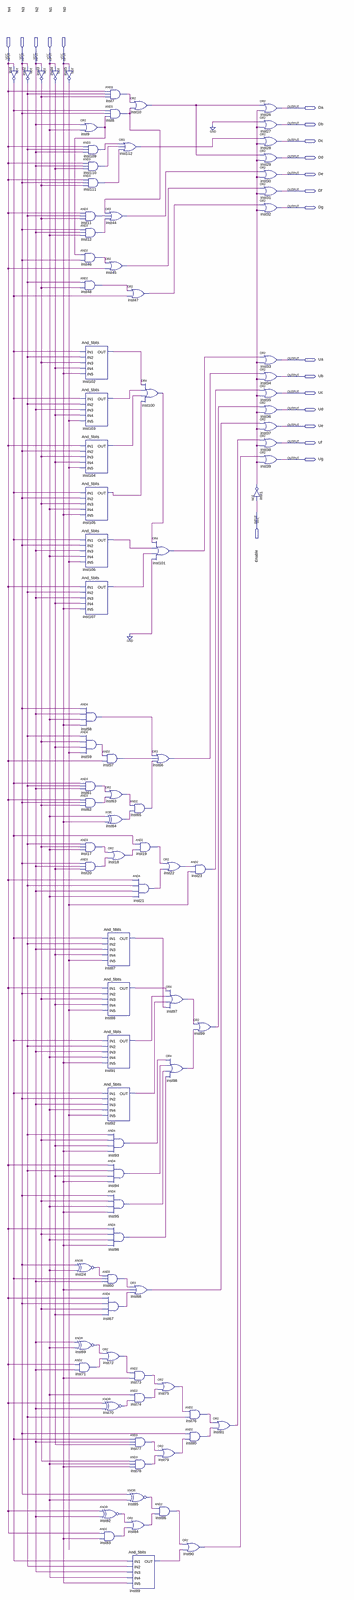
[diagram p0: schematic sheet, whole]
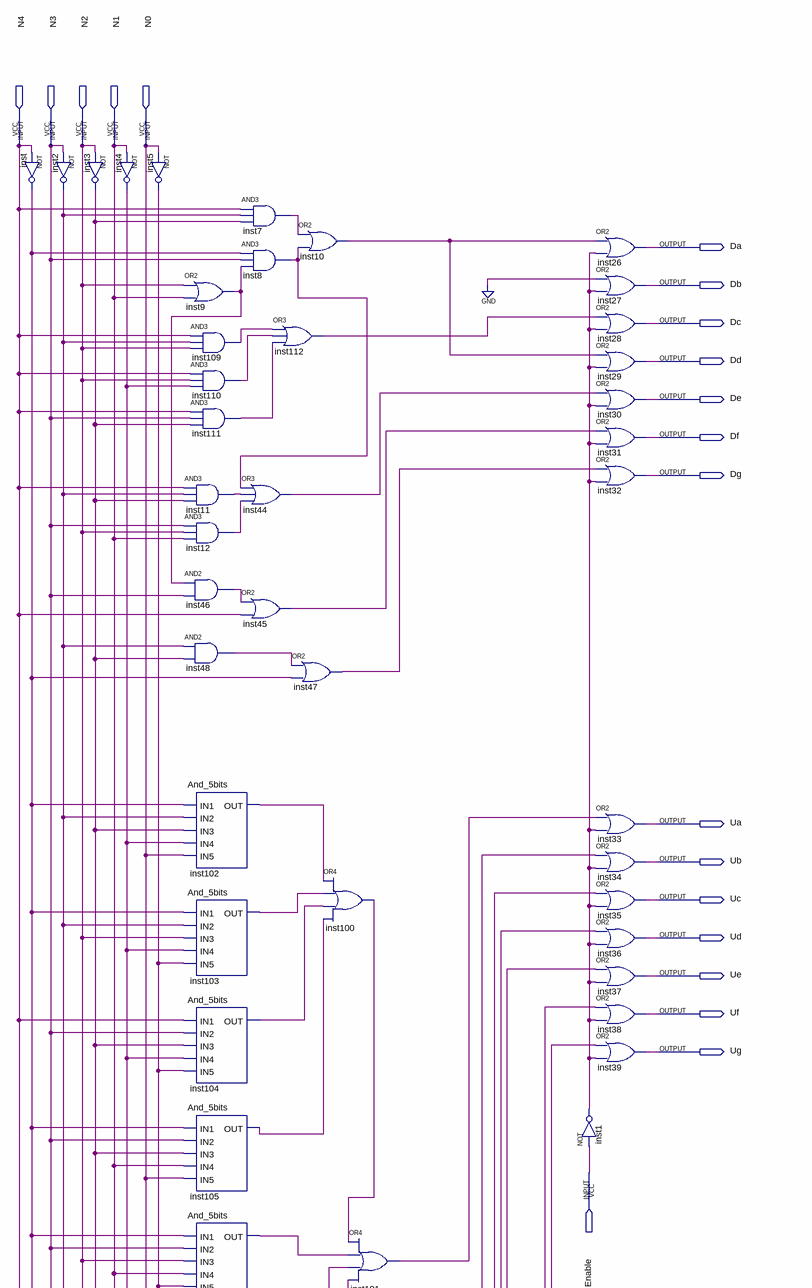
[diagram p1: schematic sheet, upper part]
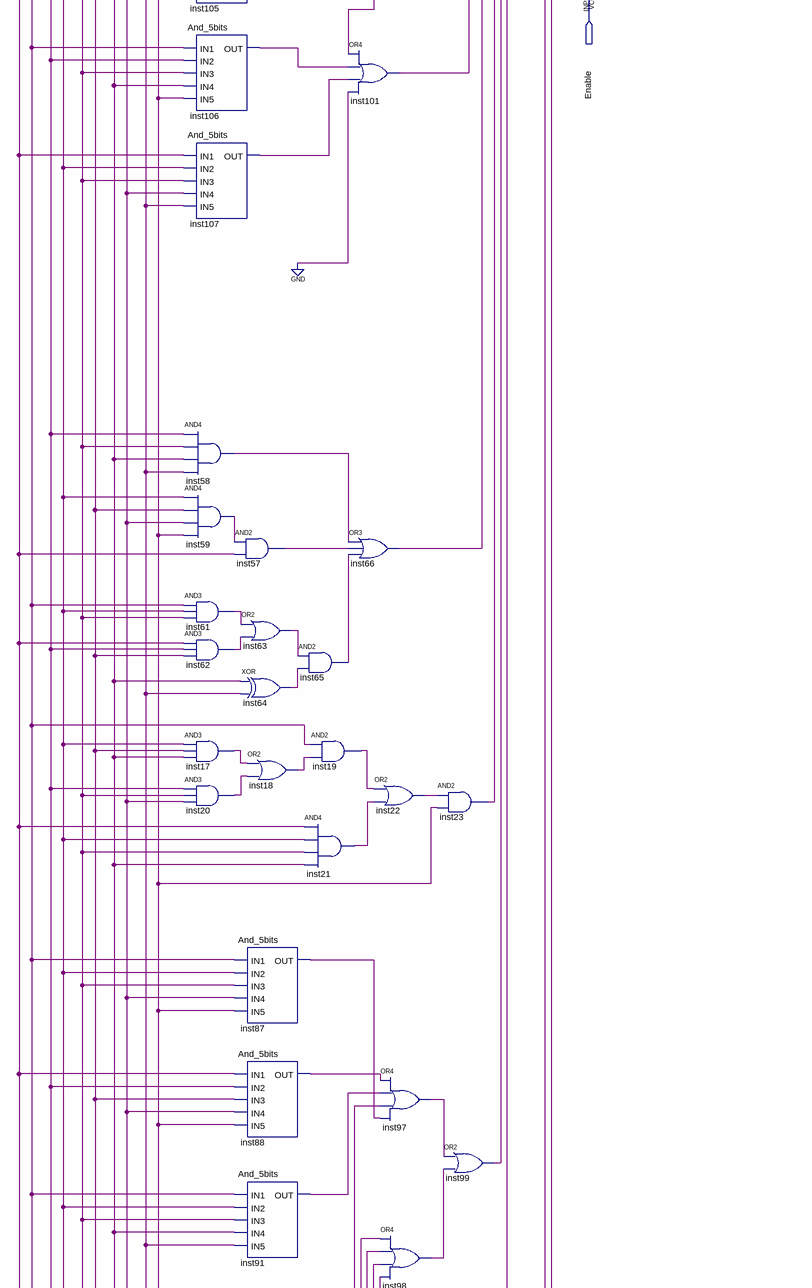
[diagram p2: schematic sheet, middle part]
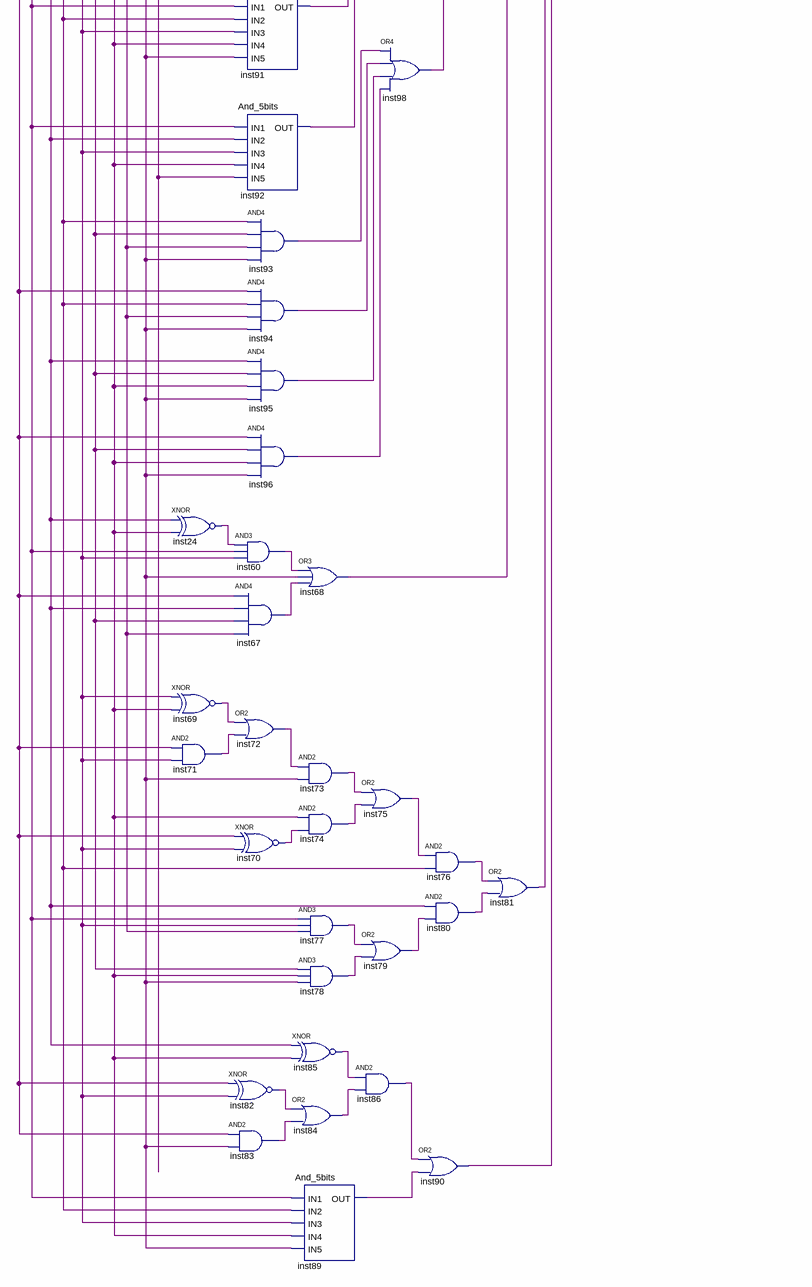
[diagram p3: schematic sheet, lower part]
// Quartus schematic 5-decoder-7-seg-2-dig.bdf as structural Verilog: 94 symbols, 20 pins
module \5-decoder-7-seg-2-dig  (
  input  N4,
  input  N3,
  input  N2,
  input  N1,
  input  N0,
  input  Enable,
  output Da,
  output Db,
  output Dc,
  output Dd,
  output De,
  output Df,
  output Dg,
  output Ua,
  output Ub,
  output Uc,
  output Ud,
  output Ue,
  output Uf,
  output Ug
);

  wire inst1_out, inst2_out, inst3_out, inst4_out, inst5_out, inst7_out, inst8_out, inst9_out, inst10_out,
       inst11_out, inst12_out, inst17_out, inst18_out, inst19_out, inst20_out, inst21_out, inst22_out,
       inst23_out, inst24_out, inst44_out, inst45_out, inst46_out, inst47_out, inst48_out, inst57_out,
       inst58_out, inst59_out, inst60_out, inst61_out, inst62_out, inst63_out, inst64_out, inst65_out,
       inst66_out, inst67_out, inst68_out, inst69_out, inst70_out, inst71_out, inst72_out, inst73_out,
       inst74_out, inst75_out, inst76_out, inst77_out, inst78_out, inst79_out, inst80_out, inst81_out,
       inst82_out, inst83_out, inst84_out, inst85_out, inst86_out, inst87_out, inst88_out, inst89_out,
       inst90_out, inst91_out, inst92_out, inst93_out, inst94_out, inst95_out, inst96_out, inst97_out,
       inst98_out, inst99_out, inst100_out, inst101_out, inst102_out, inst103_out, inst104_out, inst105_out,
       inst106_out, inst107_out, inst109_out, inst110_out, inst111_out, inst112_out, inst_out;

  not inst (inst_out, N4);
  not inst2 (inst2_out, N3);
  not inst3 (inst3_out, N2);
  not inst4 (inst4_out, N1);
  not inst5 (inst5_out, N0);
  or inst9 (inst9_out, N2, N1);
  and inst109 (inst109_out, N4, inst2_out, N2);
  and inst110 (inst110_out, N4, N2, inst4_out);
  and inst111 (inst111_out, N4, N3, inst3_out);
  and inst11 (inst11_out, N4, inst2_out, inst3_out);
  and inst12 (inst12_out, N3, N2, N1);
  and inst46 (inst46_out, inst9_out, N3);
  and inst48 (inst48_out, inst2_out, inst3_out);
  And_5bits inst102 (.IN1(inst_out), .IN2(inst2_out), .IN3(inst3_out), .IN4(inst4_out), .IN5(N0), .OUT(inst102_out));
  And_5bits inst103 (.IN1(inst_out), .IN2(inst2_out), .IN3(N2), .IN4(inst4_out), .IN5(inst5_out), .OUT(inst103_out));
  And_5bits inst104 (.IN1(N4), .IN2(N3), .IN3(inst3_out), .IN4(inst4_out), .IN5(inst5_out), .OUT(inst104_out));
  And_5bits inst105 (.IN1(inst_out), .IN2(N3), .IN3(inst3_out), .IN4(N1), .IN5(N0), .OUT(inst105_out));
  And_5bits inst106 (.IN1(inst_out), .IN2(N3), .IN3(N2), .IN4(N1), .IN5(inst5_out), .OUT(inst106_out));
  And_5bits inst107 (.IN1(N4), .IN2(inst2_out), .IN3(N2), .IN4(inst4_out), .IN5(N0), .OUT(inst107_out));
  and inst58 (inst58_out, N3, N2, N1, N0);
  and inst59 (inst59_out, inst2_out, inst3_out, inst4_out, inst5_out);
  and inst61 (inst61_out, inst_out, inst2_out, N2);
  and inst62 (inst62_out, N4, N3, inst3_out);
  and inst17 (inst17_out, inst2_out, inst3_out, N1);
  and inst20 (inst20_out, N3, N2, inst4_out);
  xnor inst24 (inst24_out, N3, N1);
  xnor inst69 (inst69_out, N2, N1);
  and inst71 (inst71_out, N4, N2);
  and inst7 (inst7_out, N4, inst2_out, inst3_out);
  and inst8 (inst8_out, inst_out, N3, inst9_out);
  or inst44 (inst44_out, inst8_out, inst11_out, inst12_out);
  or inst45 (inst45_out, inst46_out, N4);
  and inst57 (inst57_out, inst59_out, N4);
  or inst63 (inst63_out, inst61_out, inst62_out);
  xor inst64 (inst64_out, N1, N0);
  And_5bits inst87 (.IN1(inst_out), .IN2(inst2_out), .IN3(N2), .IN4(inst4_out), .IN5(inst5_out), .OUT(inst87_out));
  And_5bits inst88 (.IN1(N4), .IN2(N3), .IN3(inst3_out), .IN4(inst4_out), .IN5(inst5_out), .OUT(inst88_out));
  And_5bits inst91 (.IN1(inst_out), .IN2(inst2_out), .IN3(N2), .IN4(N1), .IN5(N0), .OUT(inst91_out));
  And_5bits inst92 (.IN1(inst_out), .IN2(N3), .IN3(N2), .IN4(N1), .IN5(inst5_out), .OUT(inst92_out));
  and inst60 (inst60_out, inst24_out, inst_out, N2);
  and inst67 (inst67_out, N4, N3, inst3_out, inst4_out);
  or inst72 (inst72_out, inst69_out, inst71_out);
  xnor inst70 (inst70_out, N4, N2);
  xnor inst82 (inst82_out, N4, N2);
  and inst83 (inst83_out, N4, N0);
  or inst112 (inst112_out, inst109_out, inst110_out, inst111_out);
  or inst47 (inst47_out, inst48_out, inst_out);
  or inst18 (inst18_out, inst17_out, inst20_out);
  and inst93 (inst93_out, inst2_out, inst3_out, inst4_out, N0);
  and inst94 (inst94_out, N4, inst2_out, inst4_out, N0);
  and inst95 (inst95_out, N3, inst3_out, N1, N0);
  and inst96 (inst96_out, N4, inst3_out, N1, N0);
  xnor inst85 (inst85_out, N3, N1);
  or inst84 (inst84_out, inst82_out, inst83_out);
  And_5bits inst89 (.IN1(inst_out), .IN2(inst2_out), .IN3(N2), .IN4(N1), .IN5(N0), .OUT(inst89_out));
  or inst10 (inst10_out, inst7_out, inst8_out);
  or inst100 (inst100_out, inst102_out, inst103_out, inst104_out, inst105_out);
  and inst65 (inst65_out, inst63_out, inst64_out);
  and inst19 (inst19_out, inst_out, inst18_out);
  and inst21 (inst21_out, N4, inst2_out, N2, N1);
  or inst68 (inst68_out, inst60_out, N0, inst67_out);
  and inst73 (inst73_out, inst72_out, N0);
  and inst74 (inst74_out, N1, inst70_out);
  and inst77 (inst77_out, inst_out, N2, inst4_out);
  and inst78 (inst78_out, inst3_out, N1, N0);
  or inst101 (inst101_out, inst100_out, inst106_out, inst107_out, 1'b0);
  or inst66 (inst66_out, inst58_out, inst57_out, inst65_out);
  or inst22 (inst22_out, inst19_out, inst21_out);
  or inst97 (inst97_out, inst88_out, inst91_out, inst92_out, inst87_out);
  or inst98 (inst98_out, inst93_out, inst94_out, inst95_out, inst96_out);
  or inst75 (inst75_out, inst73_out, inst74_out);
  or inst79 (inst79_out, inst77_out, inst78_out);
  and inst86 (inst86_out, inst85_out, inst84_out);
  and inst23 (inst23_out, inst22_out, inst5_out);
  or inst99 (inst99_out, inst97_out, inst98_out);
  and inst76 (inst76_out, inst75_out, inst2_out);
  and inst80 (inst80_out, N3, inst79_out);
  or inst90 (inst90_out, inst86_out, inst89_out);
  or inst81 (inst81_out, inst76_out, inst80_out);
  or inst26 (Da, inst10_out, inst1_out);
  or inst27 (Db, 1'b0, inst1_out);
  or inst28 (Dc, inst112_out, inst1_out);
  or inst29 (Dd, inst10_out, inst1_out);
  or inst30 (De, inst44_out, inst1_out);
  or inst31 (Df, inst45_out, inst1_out);
  or inst32 (Dg, inst47_out, inst1_out);
  or inst33 (Ua, inst101_out, inst1_out);
  or inst34 (Ub, inst66_out, inst1_out);
  or inst35 (Uc, inst23_out, inst1_out);
  or inst36 (Ud, inst99_out, inst1_out);
  or inst37 (Ue, inst68_out, inst1_out);
  or inst38 (Uf, inst81_out, inst1_out);
  or inst39 (Ug, inst90_out, inst1_out);
  not inst1 (inst1_out, Enable);
endmodule
